# EAGLE design RF1_RS485v3 (EAGLE 6.4)
RS485/Renard adapter for the RF1
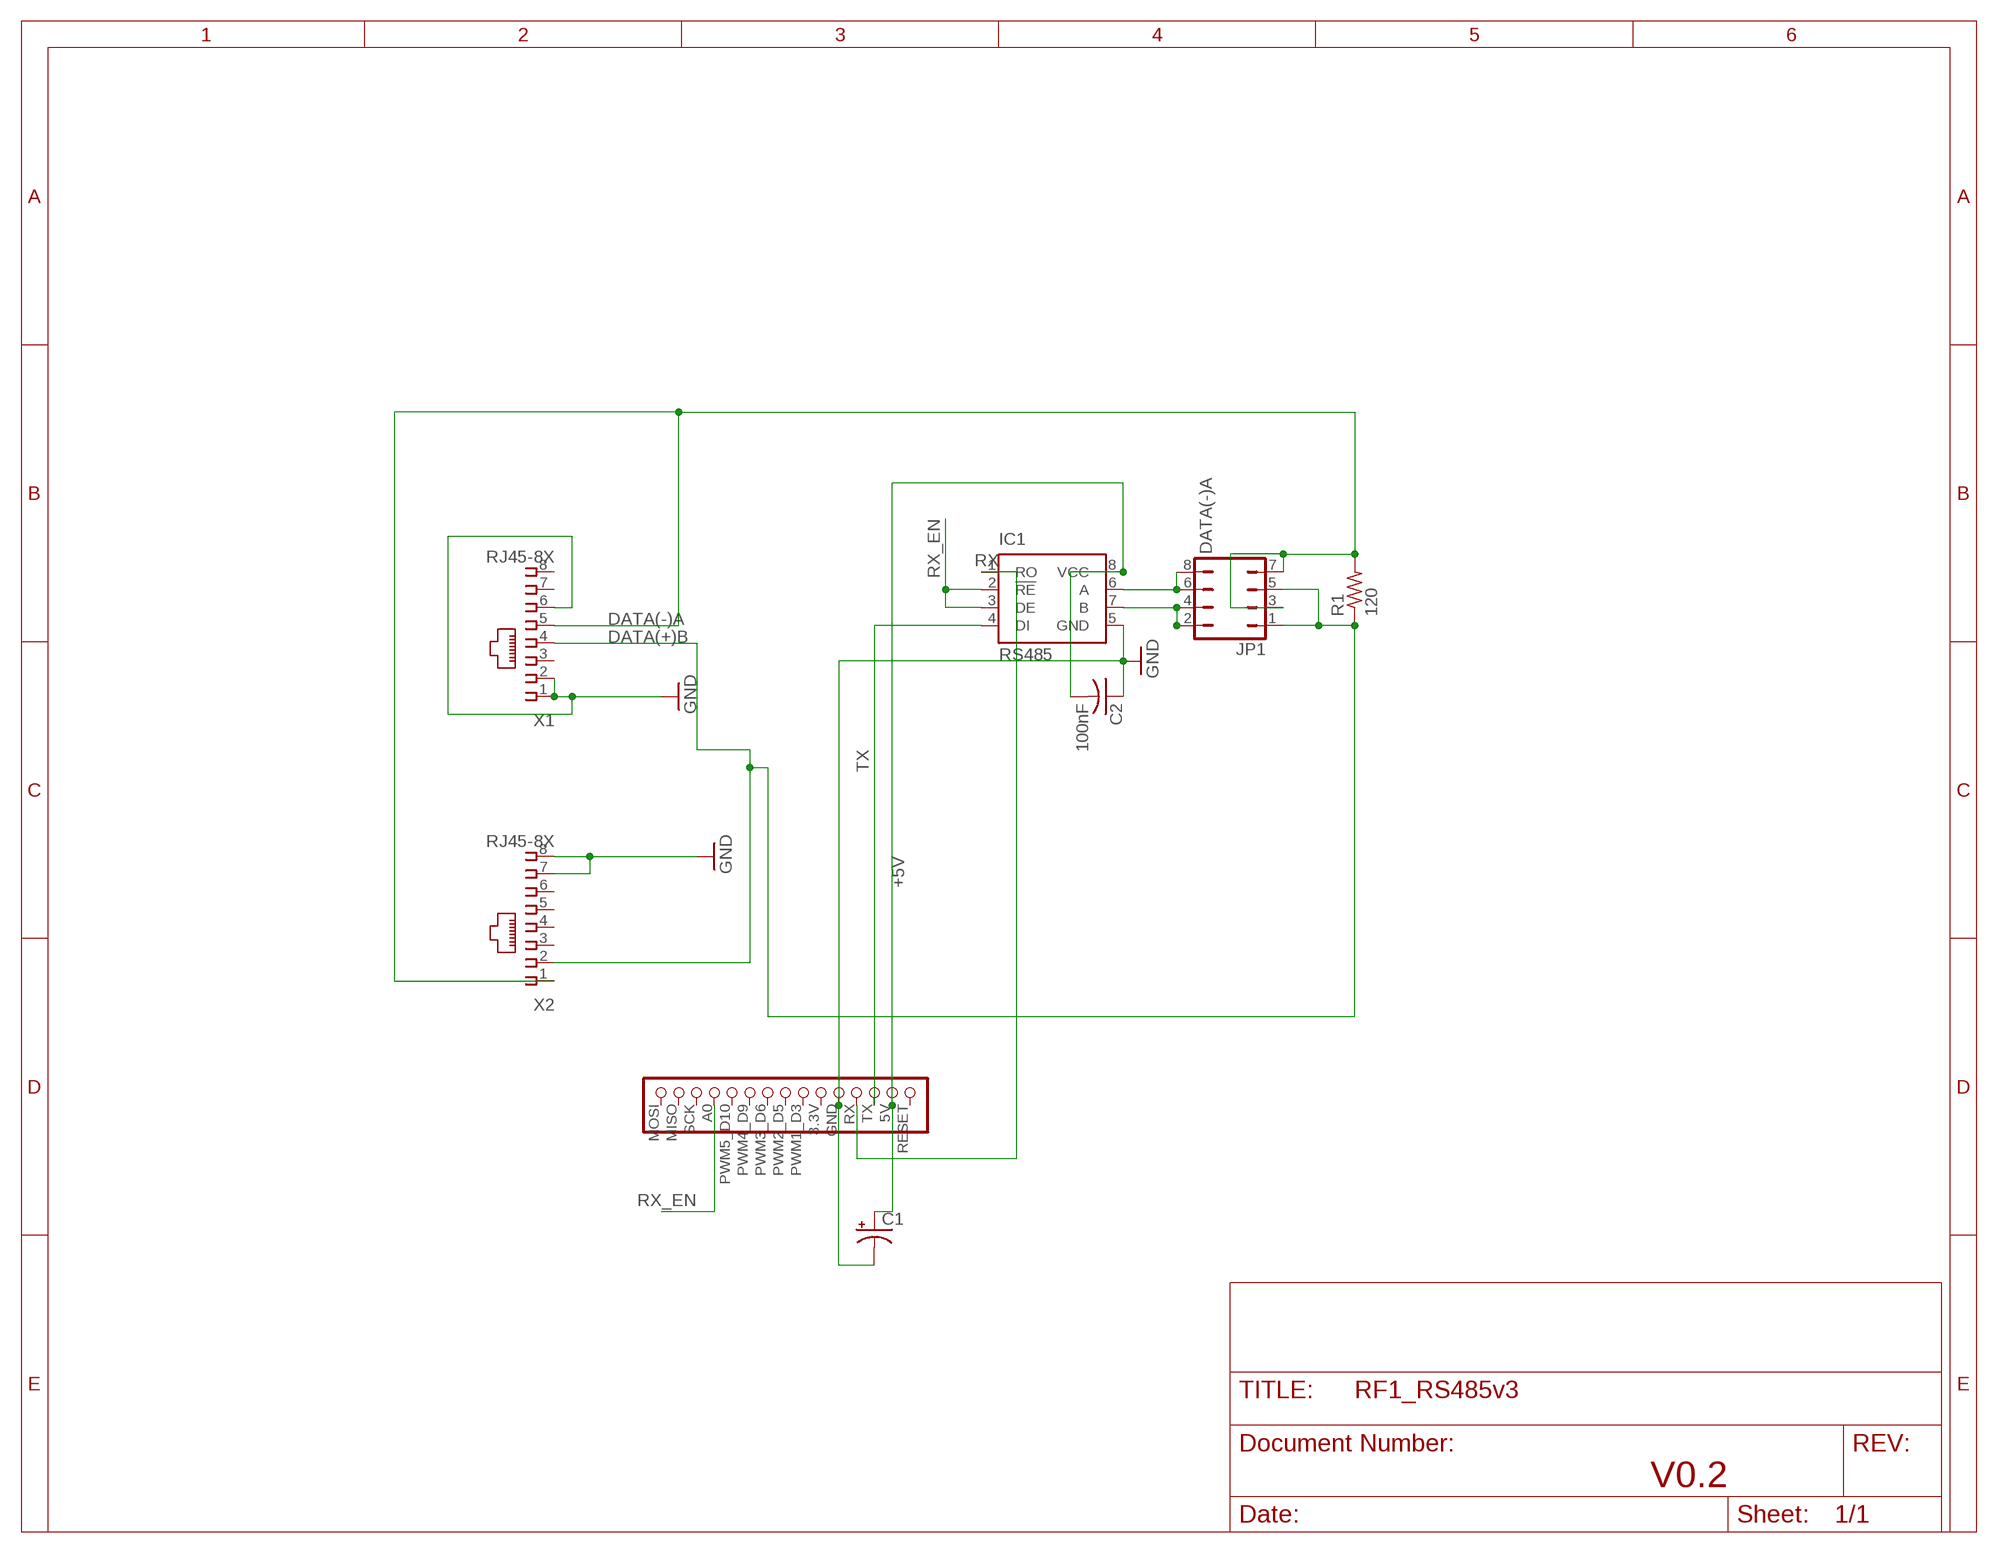
[diagram p0: schematic, sheet 1]

## Parts
C1  CPOL-USE5-5  [E5-5]
C2  100nF  C-US025-024X044  [C025-024X044]
IC1  RS485  LTC485N  [DIL08]
JP1  JP4Q  [JP4Q]
R1  120  R-US_FLIPFLOP  [0805-THM]
U$1  RF1_HEADER_LEFT  [RF1_LEFTHEADER_ONLY]
X1  RJ45-8X  [RJ45-NO-SHIELD]
X2  RJ45-8X  [RJ45-NO-SHIELD]

## Nets
+5V: C1.+ C2.2 IC1.8(VCC) U$1.5V
DATA(+)B: JP1.1 JP1.5 R1.1 X1.4 X2.2
DATA(-)A: JP1.3 JP1.7 R1.2 X1.5 X2.1
GND: C1.- C2.1 IC1.5(GND) U$1.GND X1.1 X1.2 X1.6 X2.7 X2.8
N$1: IC1.6(A) JP1.6 JP1.8
N$2: IC1.7(B) JP1.2 JP1.4
RX: IC1.1(RO) U$1.RX
RX_EN: IC1.2(!RE) IC1.3(DE) U$1.A0(PC0)
TX: IC1.4(DI) U$1.TX
Unconnected: U$1.3.3V U$1.MISO U$1.MOSI U$1.PWM1_D3(PWM1) U$1.PWM2_D5(PWM2) U$1.PWM3_D6(PWM3) U$1.PWM4_D9(PWM4) U$1.PWM5_D10(PWM5) U$1.RESET U$1.SCK X1.3 X1.7 X1.8 X2.3 X2.4 X2.5 X2.6

## Notes on the sheet
- V0.2

## Library data of the parts
C1 = adafruit:CPOL-US: POLARIZED CAPACITOR, American symbol
C2 = adafruit:C-US: CAPACITOR, American symbol
IC1 = linear-technology:LTC485: Low Power RS485 Interface Transceiver Source: http://www.linear.com/pc/downloadDocument.do?navId=H0,C1,C1007,C1017,P2064,D1718; OC_FARNELL: unknown; OC_NEWARK: unknown
JP1 = jumper:JP4Q: JUMPER
R1 = adafruit:R-US_: RESISTOR, American symbol
U$1 = komby1:RF1_HEADER_LEFT
X1 X2 = con-tycoelectronics_komby:RJ45: CORCOM Modular RJ Jacks No Shield Source: www.tycoelectronics.com .. ENG_DS_1654001_1099_RJ_L_0507.pdf; MPN: RJ45-8X; OC_FARNELL: unknown; OC_NEWARK: 16R6101

## Board
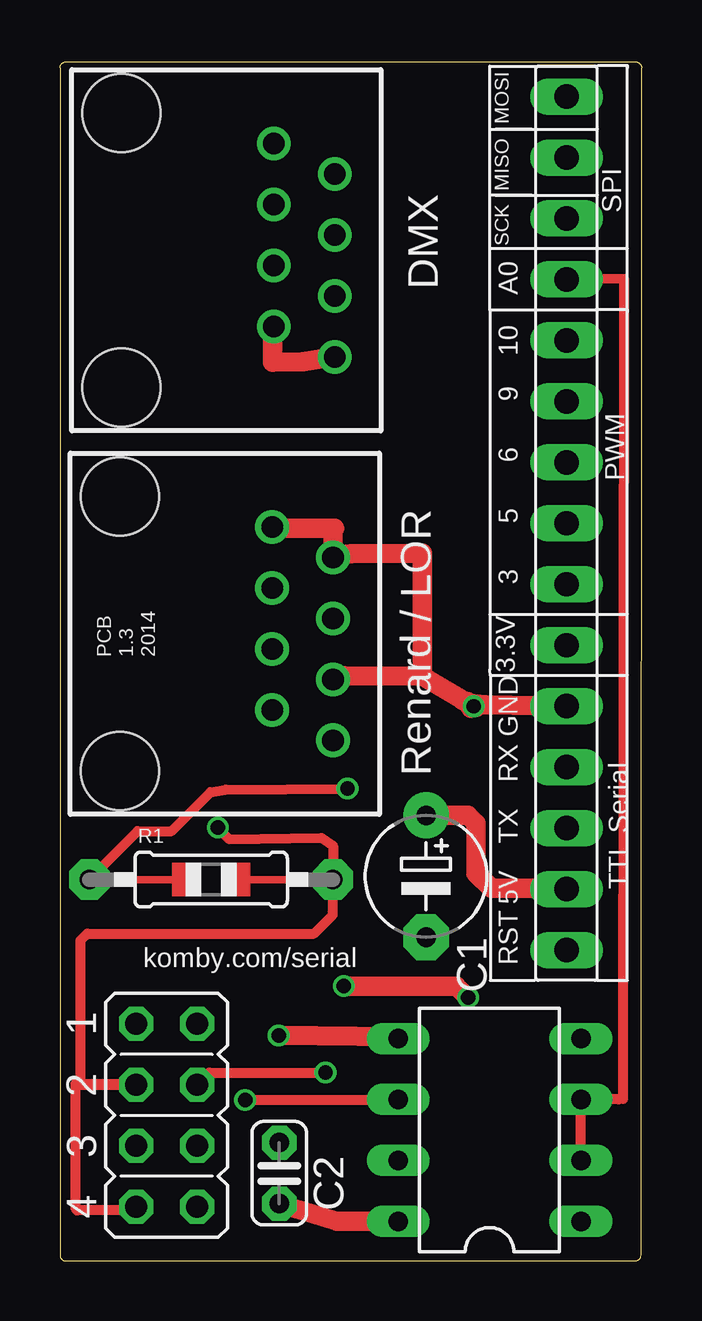
[diagram p1: board, top side]
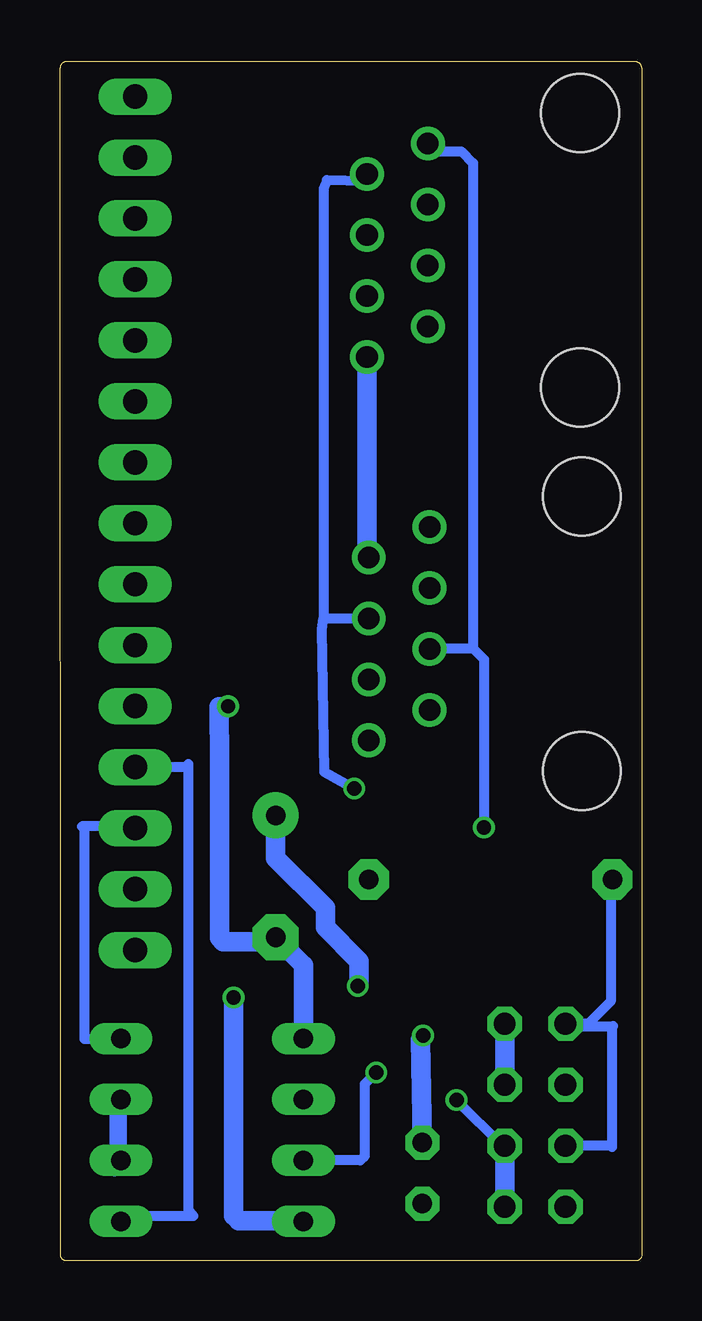
[diagram p2: board, bottom side, seen from below]

Size 24.26 x 49.96 mm. Coordinates in mm from the lower left corner, seen from the top.
Outline: 0,49.71 0,0.25 arc90 0.25,0 23.98,0 arc90 24.23,0.25 24.26,49.71 arc90 24,49.96 0.25,49.96 arc90 0,49.71
Copper layers (1*16): Top 0.035mm / dielectric 1.5mm / Bottom 0.035mm
Design rules "Fusion_eagle_rule_v1.1": minimum track width 6mil, minimum drill 12mil, track to track 6mil, track to pad 6mil, pad to pad 6mil, via to via 6mil, smd to smd 0mil, copper to edge 10mil, drill to drill 10mil, minimum pad ring 10mil, minimum via ring 6mil, stop-mask expansion 2mil, vias tented up to drill 100mil, thermal gap 10mil

### Footprints (pad centres in the part's own frame; a part is rotated, then mirrored left to right if it is on the bottom)
E5-5 = drill 0.813 pad 1.905: + -2.54,0 | drill 0.813 pad 1.905 octagon: - 2.54,0
C025-024X044 = drill 0.813 pad 1.422 octagon: 1 -1.27,0; 2 1.27,0
DIL08 = drill 0.813 long: 1 -3.81,-3.81; 2 -1.27,-3.81; 3 1.27,-3.81; 4 3.81,-3.81; 5 3.81,3.81; 6 1.27,3.81; 7 -1.27,3.81; 8 -3.81,3.81
JP4Q = drill 0.914 octagon: 1 -3.81,-1.27; 2 -3.81,1.27; 3 -1.27,-1.27; 4 -1.27,1.27; 5 1.27,-1.27; 6 1.27,1.27; 7 3.81,-1.27; 8 3.81,1.27
0805-THM = drill 0.813 pad 1.676 octagon: 1 -5.08,0; 2 5.08,0
RF1_LEFTHEADER_ONLY = drill 1.016 long: 3.3V 1.42,-5.215; 5V 1.42,-15.375; A0 1.42,10.025; GND 1.42,-7.755; MISO 1.42,15.105; MOSI 1.42,17.645; PWM1_D3 1.42,-2.675; PWM2_D5 1.42,-0.135; PWM3_D6 1.42,2.405; PWM4_D9 1.42,4.945; PWM5_D10 1.42,7.485; RESET 1.42,-17.915; RX 1.42,-10.295; SCK 1.42,12.565; TX 1.42,-12.835
RJ45-NO-SHIELD = drill 0.9 pad 1.4: 1 -4.445,6.35; 2 -3.175,8.89; 3 -1.905,6.35; 4 -0.635,8.89; 5 0.635,6.35; 6 1.905,8.89; 7 3.175,6.35; 8 4.445,8.89 | hole 3.251: -5.715,0; 5.715,0

### Placement (x,y rotation side)
C1  15.27,16.03 270 top
C2  9.14,3.66 270 top
IC1  17.91,5.46 90 top
JP1  4.45,6.07 270 top
R1  6.3,15.89 0 top
U$1  19.7,30.87 0 top
X1  2.5,26.13 270 top
X2  2.57,42.11 270 top

### Tracks (layer width: path | path; a pad name or v marks a point on that pad's centre or on a via)
+5V  (via drill 0.6)
  Top 0.813: U$1.5V 21.1,15.52 17.98,15.52 17.35,16.15 17.35,18.24 17.02,18.57 C1.+ | C2.2 11.56,1.65 IC1.8 | v17.02,10.97 16.54,11.46 v11.84,11.46
  Bottom 0.813: IC1.8 14.13,1.68 16.82,1.68 17.02,1.88 v17.02,10.97 | v11.84,11.46 11.79,11.51 11.79,12.5 13.18,13.89 13.18,14.71 15.27,16.79 C1.+
DATA(+)B  (via drill 0.6)
  Top 0.406: R1.1 3.24,17.91 4.65,17.91 6.27,19.53 6.91,19.63 v11.99,19.68
  Bottom 0.406: R1.1 1.29,15.82 1.29,10.82 2.23,9.88 JP1.1 3.07,9.78 1.19,9.78 1.25,9.73 1.25,4.75 1.29,4.8 JP1.5 | v11.99,19.68 13.23,20.37 13.34,26.31 13.26,26.77 | 13.26,26.77 X1.4 | X2.2 11.53,44.98 13.13,45.03 13.26,44.68 13.26,26.77
DATA(-)A  (via drill 0.6)
  Top 0.406: v6.58,18.06 7.06,17.58 10.9,17.63 11.38,17.3 R1.2 11.38,14.43 10.59,13.64 1.14,13.64 0.86,13.36 0.86,7.52 0.71,7.37 | JP1.7 3.02,2.11 0.71,2.11 0.66,2.16 0.66,7.42 0.71,7.37 | 0.71,7.37 0.74,7.34 JP1.3 3.15,7.37 0.71,7.37
  Bottom 0.406: X1.5 8.82,25.53 7.04,25.53 | 7.04,25.53 6.58,25.07 v6.58,18.06 | X2.1 8.87,46.23 7.52,46.23 7.04,45.74 7.04,25.53
GND  (via drill 0.6)
  Top 0.813: X1.6 11.84,24.38 15.11,24.36 | 15.11,24.36 v17.25,23.11 | v17.25,23.11 17.14,23.04 | 17.14,23.04 17.37,23.06 | 17.02,23.29 17.14,23.04 | 17.37,23.06 17.07,23.24 17.73,23.17 U$1.GND | X1.1 8.89,30.53 11.46,30.53 11.39,30.46 X1.2 11.49,29.41 12.14,29.46 15.11,29.49 15.11,24.36 | X2.7 8.87,38.51 8.87,37.44 10.13,37.47 X2.8 | IC1.5 14.02,9.35 v9.12,9.4 | v17.25,23.11 16.79,23.37 17.37,23.06
  Bottom 0.813: X1.2 11.46,29.38 X2.8 | IC1.5 14.1,12.32 C1.- 15.44,13.31 17.45,13.31 17.6,13.46 17.6,20.78 17.63,23.09 v17.25,23.11 | v9.12,9.4 9.22,9.22 C2.1
N$1  (via drill 0.6)
  Top 0.406: IC1.6 14.08,6.71 v7.72,6.71
  Bottom 0.406: v7.72,6.71 5.82,4.8 JP1.6
  Bottom 0.813: JP1.6 JP1.8
N$2  (via drill 0.6)
  Top 0.406: JP1.4 6.22,7.85 v11.07,7.85
  Bottom 0.406: v11.07,7.85 11.56,7.37 11.56,4.37 11.74,4.19 IC1.7
  Bottom 0.813: JP1.4 JP1.2
RX
  Bottom 0.406: IC1.1 21.49,1.88 18.69,1.88 18.9,2.08 18.9,20.7 19.02,20.57 U$1.RX
RX_EN
  Top 0.406: U$1.A0 21.17,40.95 23.52,40.92 23.47,6.76 23.3,6.73 IC1.3 IC1.2
  Bottom 0.406: IC1.3 22,6.45 22,3.73 21.67,4.06 21.67,6.6 21.72,6.66 21.72,6.71
TX
  Bottom 0.406: U$1.TX 21.2,18.11 23.34,18.11 23.24,18.01 23.24,9.25 23.22,9.27 IC1.4

### Text on the board
tNames: DMX | PCB / 1.3 / 2014 | Renard / LOR | komby.com/serial